# EAGLE design McPiFace-60mmFan-V3.1 (EAGLE 7.4.0)
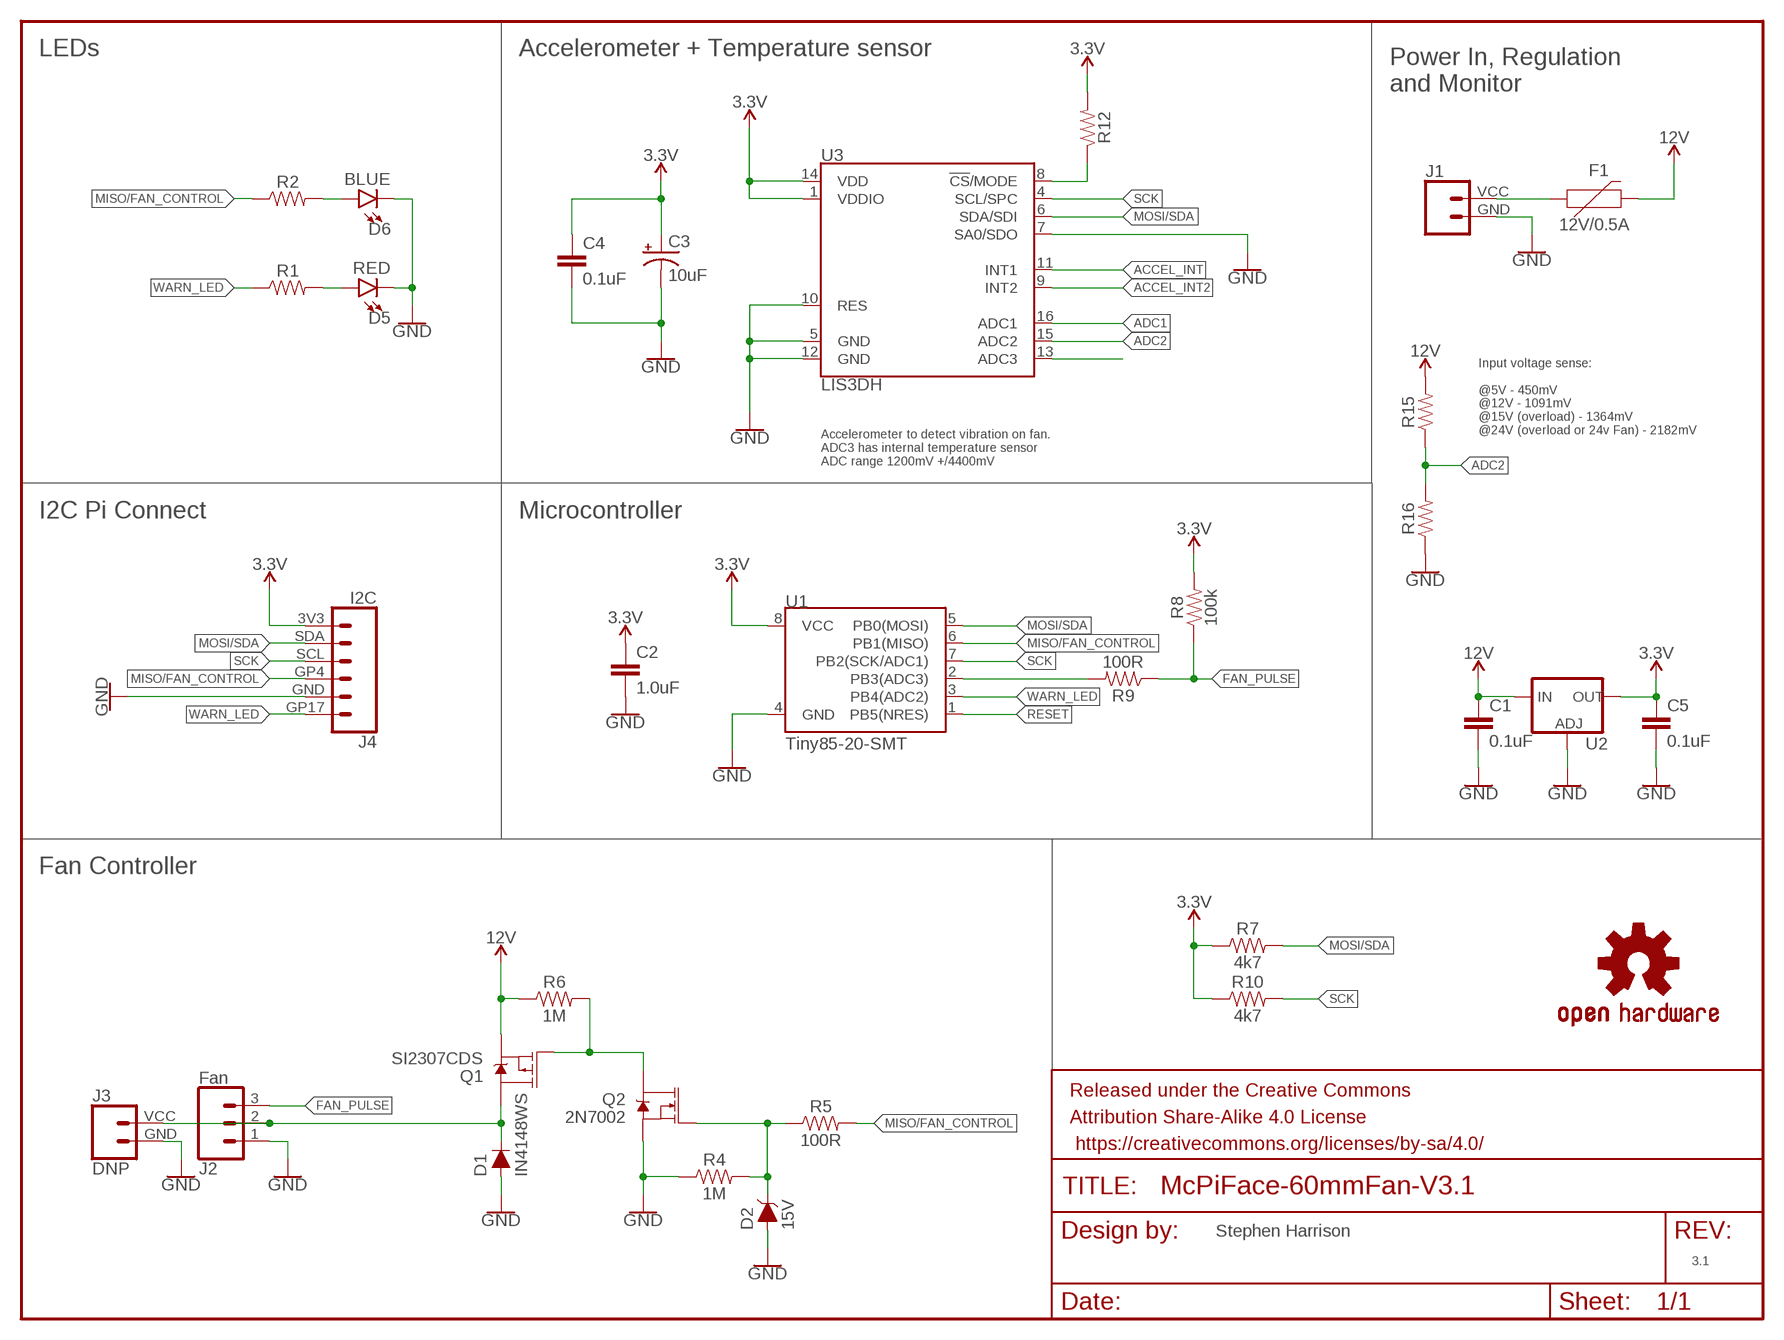
[diagram p0: schematic, sheet 1]

## Parts
C1  0.1uF  0.1UF-0805-25V  [0805]
C2  1.0uF  1.0UF-0805-25V-10%  [0805]
C3  10uF  10UF-16V-10%(TANT)  [EIA3216]
C4  0.1uF  1.0UF-0805-25V-10%  [0805]
C5  0.1uF  0.1UF-0805-25V  [0805]
D1  IN4148WS  DIODE-BAS16J  [SOD-323]
D2  15V  DIODE-ZENER-BZT52C3V6S  [SOD-323]
D5  RED  LED1206  [LED-1206]
D6  BLUE  LED1206  [LED-1206]
F1  12V/0.5A  PPTC_HALF-AMP  [1206]
FRAME1  FRAME-LETTER  [CREATIVE_COMMONS]
J1  CONN_024UCON-15767  [JST-2-SMD-VERT]
J2  Fan  CONN_03JST-SMD  [JST-3-SMD]
J3  DNP  CONN_024UCON-15767  [JST-2-SMD-VERT]
J4  I2C  MC_PI_FACE_I2CTOP  [JST-6-SH-1.0MM-TOP]
LOGO1  OSHW-LOGOL  [OSHW-LOGO-L]
Q1  SI2307CDS  MOSFET_PCH-IRLML2244  [SOT23-3]
Q2  2N7002  MOSFET-NCH-BSS138  [SOT23-3]
R1  RESISTOR0805  [0805]
R2  RESISTOR0805  [0805]
R4  1M  RESISTOR0805  [0805]
R5  100R  RESISTOR0805  [0805]
R6  1M  RESISTOR0805  [0805]
R7  4k7  RESISTOR0805  [0805]
R8  100k  RESISTOR0805  [0805]
R9  100R  RESISTOR0805  [0805]
R10  4k7  RESISTOR0805  [0805]
R12  RESISTOR0805  [0805]
R15  RESISTOR0805  [0805]
R16  RESISTOR0805  [0805]
U1  Tiny85-20-SMT  ATTINY45TINY85-20-SMT  [SO08-EIAJ]
U2  V_REG_LM1117SOT223  [SOT223]
U3  LIS3DH  [LGA-16-3X3]

## Nets
3.3V: C2.1 C3.A(+) C4.1 C5.1 J4.3V3 R7.1 R8.2 R10.1 R12.2 U1.8(VCC) U2.2(OUT) U2.4(OUT) U3.1(VDDIO) U3.14(VDD)
12V: C1.1 F1.2 Q1.2(S) R6.1 R15.2 U2.3(IN)
ACCEL_INT: U3.11(INT1)
ACCEL_INT2: U3.9(INT2)
ADC1: U3.16(ADC1)
ADC2: R15.1 R16.2 U3.15(ADC2)
FAN_PULSE: J2.3 R8.1 R9.1
GND: C1.2 C2.2 C3.C(-) C4.2 C5.2 D1.A D2.A D5.C D6.C J1.GND J2.1 J3.GND J4.GND Q2.2(S) R4.1 R16.1 U1.4(GND) U2.1(ADJ) U3.5(GND) U3.7(SA0/SDO) U3.10(RES) U3.12(GND)
MISO/FAN_CONTROL: J4.GP4 R2.1 R5.2 U1.6(PB1(MISO))
MOSI/SDA: J4.SDA R7.2 U1.5(PB0(MOSI)) U3.6(SDA/SDI)
N$1: R9.2 U1.2(PB3(ADC3))
N$3: D6.A R2.2
N$4: D5.A R1.2
N$5: U3.13(ADC3)
N$6: F1.1 J1.VCC
N$7: R12.1 U3.8(!CS!/MODE)
N$8: D1.C J2.2 J3.VCC Q1.3(D)
N$10: Q1.1(G) Q2.3(D) R6.2
N$11: D2.C Q2.1(G) R4.2 R5.1
RESET: U1.1(PB5(NRES))
SCK: J4.SCL R10.2 U1.7(PB2(SCK/ADC1)) U3.4(SCL/SPC)
WARN_LED: J4.GP17 R1.1 U1.3(PB4(ADC2))

## Notes on the sheet
- LEDs | Accelerometer + Temperature sensor
- Power In, Regulation 
  and Monitor
- Input voltage sense:
  
  @5V - 450mV
  @12V - 1091mV
  @15V (overload) - 1364mV
  @24V (overload or 24v Fan) - 2182mV
- Accelerometer to detect vibration on fan.
  ADC3 has internal temperature sensor
  ADC range 1200mV +/4400mV
- I2C Pi Connect | Microcontroller
- Fan Controller
- Stephen Harrison
- 3.1

## Library data of the parts
C1 C5 = ThingySticks:0.1UF: 0.1µF ceramic capacitors A capacitor is a passive two-terminal electrical component used to store electrical energy temporarily in an electric field.
C2 = SparkFun-Capacitors:1.0UF: 1µF ceramic capacitors A capacitor is a passive two-terminal electrical component used to store electrical energy temporarily in an electric field.; PROD_ID: CAP-08064
C3 = SparkFun-Capacitors:10UF-16V-10%(TANT): CAP-00811 1206/EIA-3216 Tantalum capacitor; PROD_ID: CAP-00811
C4 = SparkFun-Capacitors:1.0UF: 1µF ceramic capacitors A capacitor is a passive two-terminal electrical component used to store electrical energy temporarily in an electric field.; PROD_ID: CAP-08064; VALUE: 1.0uF
D1 = SparkFun-DiscreteSemi:DIODE: Diode These are standard reverse protection diodes and small signal diodes. SparkFun Products: SparkFun SparkPunk Sound Kit <https://www.sparkfun.com/products/11177> SparkFun ESP8266 Thing <https://www.sparkfun.com/products/13231>; LCSC: C2128; PROD_ID: DIO-09646; VALUE: 250mA/100V
D2 = SparkFun-DiscreteSemi:DIODE-ZENER: Zener Diode A Zener diode allows current to flow from its anode to its cathode like a normal semiconductor diode, but it also permits current to flow in the reverse direction when its "Zener voltage" is reached. - WIkipedia; PROD_ID: DIO-08199; VALUE: 3.6V
D5 D6 = ThingySticks:LED: LED (Generic) Standard schematic elements and footprints for 5mm, 3mm, 1206, and 0603 sized LEDs. Generic LEDs with no color specified.
F1 = SparkFun-Fuses:PPTC: Resettable Fuse PPTC Resettable Fuse. Really a sort of resistor with a polymeric positive temperature coefficient whose resistance increases dramatically with an increase in temperature. When heated by the power passing through the resistance rises causing the current to be limited, protecting the circuit. This is achieved by the transition of the polymer from a crystalline to an amorphous state where the conductive carbon separates breaking the conductive pathways found in the cool crystalline structure. When a PPTC cools back down it resumes conducting letting the circuit turn back on. SparkFun Products: SparkFun RedBoard - Programmed with Arduino <https://www.sparkfun.com/products/12757> Pro Micro - 5V/16MHz <https://www.sparkfun.com/products/12640> Arduino Pro 328 - 5V/16MHz <https://www.sparkfun.com/products/10915> MP3 Trigger <https://www.sparkfun.com/products/13720>; PROD_ID: RES-08585; VALUE: 6V/0.5A
FRAME1 = SparkFun-Aesthetics:FRAME-LETTER: Schematic Frame - Letter Standard 8.5x11 US Letter frame
J1 J3 = SparkFun-Connectors:CONN_02: Multi connection point. Often used as Generic Header-pin footprint for 0.1 inch spaced/style header connections On any of the 0.1 inch spaced packages, you can populate with these: Break Away Headers - Straight <https://www.sparkfun.com/products/116> (PRT-00116) Break Away Male Headers - Right Angle <https://www.sparkfun.com/products/553> (PRT-00553) Female Headers <https://www.sparkfun.com/products/115> (PRT-00115) Break Away Headers - Machine Pin <https://www.sparkfun.com/products/117> (PRT-00117) Break Away Female Headers - Swiss Machine Pin <https://www.sparkfun.com/products/743> (PRT-00743) For SCREWTERMINALS and SPRING TERMINALS visit here: Screw Terimnals on SparkFun.com <https://www.sparkfun.com/search/results?term=Screw+Terminals> (5mm/3.5mm/2.54mm spacing) This device is also useful as a general connection point to wire up your design to another part of your project. Our various solder wires solder well into these plated through hole pads. Hook-Up Wire - Assortment (Stranded, 22 AWG) <https://www.sparkfun.com/products/11375> (PRT-11375) Hook-Up Wire - Assortment (Solid Core, 22 AWG) <https://www.sparkfun.com/products/11367> (PRT-11367) View the entire wire category on our website here <https://www.sparkfun.com/categories/141> Special notes: Molex polarized connector foot print use with: PRT-08233 with associated crimp pins and housings. 2.54_SCREWTERM for use with PRT-10571. 3.5mm Screw Terminal footprints for PRT-08084 5mm Screw Terminal footprints for use with PRT-08432
J2 = SparkFun-Connectors:CONN_03: Multi connection point. Often used as Generic Header-pin footprint for 0.1 inch spaced/style header connections On any of the 0.1 inch spaced packages, you can populate with these: Break Away Headers - Straight <https://www.sparkfun.com/products/116> (PRT-00116) Break Away Male Headers - Right Angle <https://www.sparkfun.com/products/553> (PRT-00553) Female Headers <https://www.sparkfun.com/products/115> (PRT-00115) Break Away Headers - Machine Pin <https://www.sparkfun.com/products/117> (PRT-00117) Break Away Female Headers - Swiss Machine Pin <https://www.sparkfun.com/products/743> (PRT-00743) Stackable Header - 3 Pin (Female, 0.1") <https://www.sparkfun.com/products/13875> (PRT-13875) For SCREWTERMINALS and SPRING TERMINALS visit here: Screw Terimnals on SparkFun.com <https://www.sparkfun.com/search/results?term=Screw+Terminals> (5mm/3.5mm/2.54mm spacing) This device is also useful as a general connection point to wire up your design to another part of your project. Our various solder wires solder well into these plated through hole pads. Hook-Up Wire - Assortment (Stranded, 22 AWG) <https://www.sparkfun.com/products/11375> (PRT-11375) Hook-Up Wire - Assortment (Solid Core, 22 AWG) <https://www.sparkfun.com/products/11367> (PRT-11367) View the entire wire category on our website here <https://www.sparkfun.com/categories/141> Special notes: Molex polarized connector foot print use with SKU : PRT-08232 with associated crimp pins and housings.; FARNELL: 9492623; MFG: S3B-PH-SM4-TB(LF)(SN); PROD_ID: CONN-12591; VALUE: 3-PIN SMD
J4 = McPiFace:MC_PI_FACE_I2C
LOGO1 = SparkFun-Aesthetics:OSHW-LOGO: Open-Source Hardware (OSHW) Logo This logo indicates the piece of hardware it is found on incorporates a OSHW license and/or adheres to the definition of open source hardware found here: http://freedomdefined.org/OSHW
Q1 = SparkFun-DiscreteSemi:MOSFET_PCH: P-channel MOSFETs Voltage controlled devices that allow control of high current outputs. SparkFun Products: SparkFun ESP32 Thing <https://www.sparkfun.com/products/13907> SparkFun ESP8266 Thing <https://www.sparkfun.com/products/13231>; FARNELL: 1779262; LCSC: C189813; PROD_ID: TRANS-11153; VALUE: 4.3A/20V/54mΩ
Q2 = SparkFun-DiscreteSemi:MOSFET-NCH: N-channel MOSFETs Voltage controlled devices that allow control of high current outputs. SparkFun Products: SparkFun OpenScale <https://www.sparkfun.com/products/13261> SparkFun Digital Sandbox <https://www.sparkfun.com/products/12651> SparkFun Monster Moto Shield <https://www.sparkfun.com/products/10182> SparkFun MOSFET Power Controller <https://www.sparkfun.com/products/11214>; FARNELL: 1510761; PROD_ID: TRANS-00830; VALUE: 220mA/50V/3.5Ω
R1 R2 R4-R10 R12 R15 R16 = SparkFun-Resistors:RESISTOR: Generic Resistor Package
U1 = SparkFun-DigitalIC:ATTINY45: Atmel 8-pin 2/4/8kB flash uC; PROD_ID: IC-09092
U2 = SparkFun-IC-Power:V_REG_LM1117: Voltage Regulator LM1117 Standard adjustable voltage regulator but in SMD form. Spark Fun Electronics SKU : COM-00595; LCSC: C126027; PROD_ID: VREG-08170
U3 = SparkFun-Sensors:LIS3DH: ST Microelectronics LIS3DH 3-Axis ±2/4/8/16g SPI/I2C Accelerometer The LIS3DH is a three axis MEMS linear accelerometer in the "nano" family. It has a digital I2C/SPI serial interface which makes it ideal for using in embedded applications. The device also features ultra low-power operational modes that allow advanced power saving and smart sleep to wake-up functions, built in detections with interrupts, and auxiliary ADC inputs Datasheet-XXXX <http://www.sparkfun.com/datasheets/Sensors/Accelerometer/LIS3DH.pdf> SparkFun Products SparkFun Triple Axis Accelerometer Breakout - LIS3DH <https://www.sparkfun.com/products/10345> (SEN-XXXXX) Triple Axis Accelerometer - LIS3DH <https://www.sparkfun.com/products/9755> (SEN-XXXXX); PROD_ID: IC-13419; SF_ID: N/A

## Board
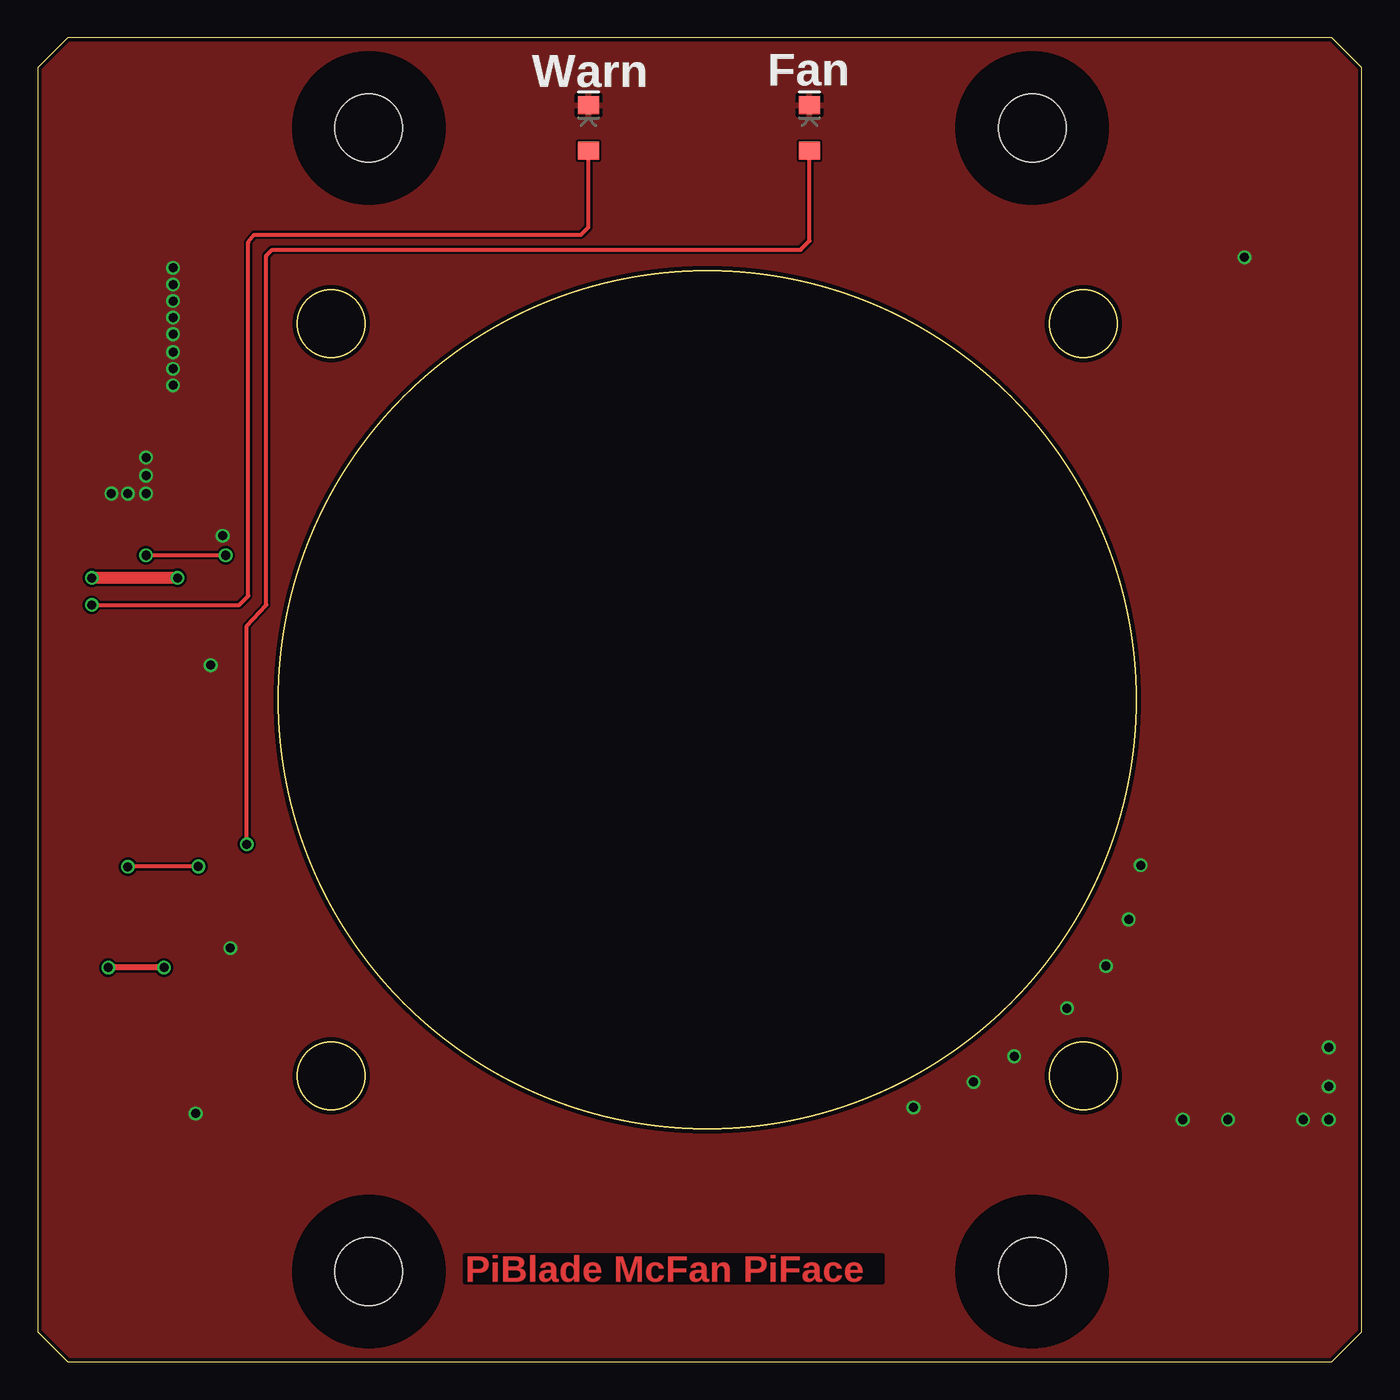
[diagram p1: board, top side]
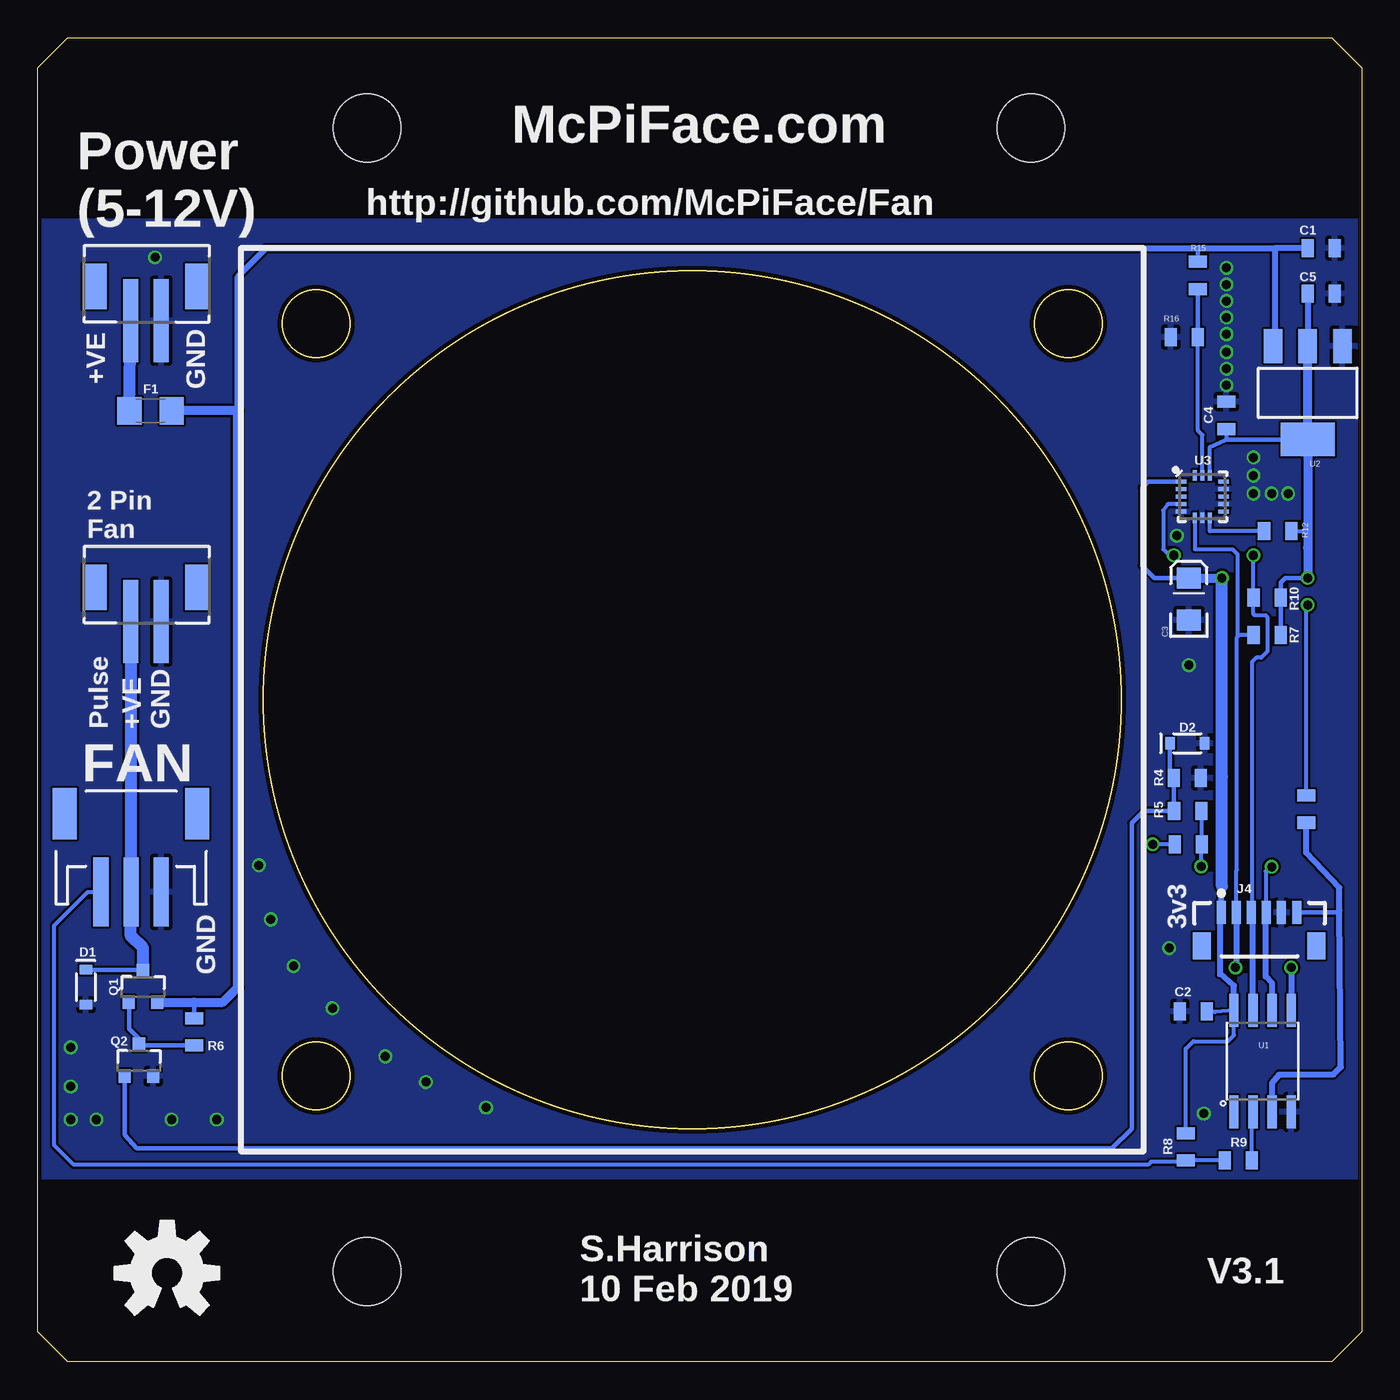
[diagram p2: board, bottom side, seen from below]

Size 88 x 88 mm. Coordinates in mm from the lower left corner, seen from the top.
Outline: 2,0 86,0 88,2 88,86 86,88 2,88 0,86 0,2 2,0
Outline: circle at 44.5,44 radius 28.5
Outline: circle at 19.5,69 radius 2.25
Outline: circle at 69.5,69 radius 2.25
Outline: circle at 69.5,19 radius 2.25
Outline: circle at 19.5,19 radius 2.25
Copper layers (1*16): Top 0.035mm / dielectric 1.5mm / Bottom 0.035mm
Design rules "dirt_cheap_dirty_boards.v1.1": minimum track width 6mil, minimum drill 12mil, track to track 6mil, track to pad 6mil, pad to pad 6mil, via to via 6mil, smd to smd 0mil, copper to edge 10mil, drill to drill 10mil, minimum pad ring 10mil, minimum via ring 6mil, stop-mask expansion 2mil, vias tented up to drill 25mil, thermal gap 10mil
Holes 4.5 mm at 22,6 22,82 66.1,82 66.1,6
bKeepout: area 0,76 to 88,88; area 0,0 to 88,12.1
tRestrict: area 17,77 to 27,87; area 17,1 to 27,11; area 61.1,1 to 71.1,11; area 61.1,77 to 71.1,87
bRestrict: area 0,76 to 88,88; area 0,0 to 88,12.1

### Footprints (pad centres in the part's own frame; a part is rotated, then mirrored left to right if it is on the bottom)
0805 = smd 0.8 x 1.2: 1 -0.9,0; 2 0.9,0
EIA3216 = smd 1.4 x 1.6: A 1.4,0; C -1.4,0
SOD-323 = smd 0.63 x 0.83: A 1.15,0; C -1.15,0
LED-1206 = smd 1.2 x 1.4: A -1.5,0; C 1.5,0
1206 = smd 1.6 x 1.8: 1 -1.4,0; 2 1.4,0
JST-2-SMD-VERT = smd 1 x 5.5: GND 1,-2; VCC -1,-2 | smd 1.6 x 3: P$1 -3.4,0.27; P$2 3.4,0.27
JST-3-SMD = smd 1 x 4.6: 1 2.01,-4.77; 2 0.01,-4.77; 3 -1.99,-4.77 | smd 1.6 x 3.4: NC1 -4.39,0.43; NC2 4.41,0.43
JST-6-SH-1.0MM-TOP = smd 0.6 x 1.55: 3V3 -2.54,1.27; GND 1.46,1.27; GP4 0.46,1.27; GP17 2.46,1.27; SCL -0.54,1.27; SDA -1.54,1.27 | smd 1.2 x 1.8: P$1 -3.84,-0.955; P$2 3.76,-0.955
SOT23-3 = smd 0.8 x 0.9: 1 -0.95,-1; 2 0.95,-1; 3 0,1.1
SO08-EIAJ = smd 0.61 x 2.21: 1 -1.905,-3.378; 2 -0.635,-3.378; 3 0.635,-3.378; 4 1.905,-3.378; 5 1.905,3.353; 6 0.635,3.353; 7 -0.635,3.353; 8 -1.905,3.353
SOT223 = smd 1.219 x 2.235: 1 -2.311,-3.099; 2 0,-3.099; 3 2.311,-3.099 | smd 3.6 x 2.2: 4 0,3.099
LGA-16-3X3 = smd 0.7 x 0.28: 1 -1.4,1; 2 -1.4,0.5; 3 -1.4,0; 4 -1.4,-0.5; 5 -1.4,-1; 9 1.4,-1; 10 1.4,-0.5; 11 1.4,0; 12 1.4,0.5; 13 1.4,1 | smd 0.28 x 0.7: 6 -0.5,-1.4; 7 0,-1.4; 8 0.5,-1.4; 14 0.5,1.4; 15 0,1.4; 16 -0.5,1.4

### Placement (x,y rotation side)
C1  2.7,74 0 bottom
C2  11.2,23.3 180 bottom
C3  11.5,50.7 90 bottom
C4  9,62.9 90 bottom
C5  2.7,71 0 bottom
D1  84.8,24.9 270 bottom
D2  11.6,41.1 0 bottom
D5  36.6,82 90 top
D6  51.3,82 90 top
F1  80.5,63.2 0 bottom
FRAME1  6.2,-14.8 0 top  (outside the outline)
J1  80.8,71.2 0 bottom
J2  81.8,36 0 bottom
J3  80.8,51.2 0 bottom
J4  6.8,28.6 0 bottom
LOGO1  79.4,5.9 0 bottom
Q1  81,24.9 0 bottom
Q2  81.27,20 0 bottom
R1  3.69,36.73 90 bottom
R2  11.53,34.38 180 bottom
R4  11.6,38.8 180 bottom
R5  11.58,36.6 0 bottom
R6  77.6,21.93 270 bottom
R7  6.3,48.3 180 bottom
R8  11.7,14.3 90 bottom
R9  8.2,13.4 0 bottom
R10  6.3,50.8 180 bottom
R12  5.6,55.2 0 bottom
R15  10.9,72.2 90 bottom
R16  11.8,68.1 0 bottom
U1  6.6,20 0 bottom
U2  3.6,64.4 180 bottom
U3  10.6,57.5 0 bottom

### Tracks (layer width: path | path; a pad name or v marks a point on that pad's centre or on a via)
3.3V  (via drill 0.6)
  Top 0.813: v9.3,52.1 v3.6,52.1
  Bottom 0.254: U3.14 10.1,60.8 9,61.3 C4.1 | R12.2 3.6,55.2 | 9.6,38.8 9.3,38.9 | C2.1 9.75,23.25 U1.8 8.5,23.25 8.5,21.7 8.9,21.3 11.2,21.3 11.7,20.8 R8.2 | 9.5,25.7 9.4,25.8
  Bottom 0.305: 9,61.3 3.7,61.3 | 3.7,54 3.6,54.1 | R7.1 R10.1 5.4,51.8 5.1,52.1 v3.6,52.1 | U3.1 14.2,58.5 14.6,58.1 14.6,52.9 13.8,52.1 C3.A | 3.6,55.2 3.6,55.3
  Bottom 0.406: C5.1 U2.2 | 3.7,55.4 3.6,55.3 | 3.7,61.3 U2.4 | 9.3,31.6 9.34,33.16 J4.3V3 9.4,29.81 9.4,25.8 8.51,25 U1.8
  Bottom 0.61: v3.6,52.1 3.6,54.1 3.6,55.2 U2.4 U2.2 | C3.A v9.3,52.1
  Bottom 0.813: 9.3,31.6 9.3,38.9 v9.3,52.1
12V
  Bottom 0.305: R15.2 10.9,74 | R6.1 77.6,23.9
  Bottom 0.406: 6,66.69 U2.3 | 74.7,63.2 74.7,72.1 72.8,74 10.9,74 5.8,74 | 5.8,74 5.8,66.71 | C1.1 5.8,74
  Bottom 0.61: 5.8,66.71 U2.3 | Q1.2 77.6,23.9 75.7,23.9 74.7,24.9 74.7,63.2 F1.2
ADC2
  Bottom 0.254: U3.15 10.6,61.6 10.9,61.9 10.9,68.8
  Bottom 0.305: 10.9,68.8 R16.2 R15.1
FAN_PULSE
  Bottom 0.254: J2.3 84.68,31.22 86.9,29 86.9,14.4 85.6,13.1 14.2,13.1 14,13.3 11.9,13.3 R8.1 R9.1
  Bottom 0.305: 83.69,31.14 J2.3
  Bottom 0.406: 83.96,31.06 J2.3 83.9,31.12
GND  (via drill 0.6)
  other vias: 80.2,73.4 11.5,46.3 9,67.1 12.8,27.5 10.5,16.5 12.3,54.9 7.2,57.7 9,68.3 9,69.4 9,70.5 9,71.6 9,66 9,64.9 7.2,58.9 7.2,60.1 6,57.7 4.9,57.7 9,72.7 76.1,16.1 79.1,16.1 84.1,16.1 85.8,16.1 85.8,18.3 85.8,20.9 71,26.3 64.9,20.3 62.2,18.6 58.2,16.9 68.4,23.5 72.5,29.4 73.3,33
  pour Top: -1,88.5 88.7,88.5 88.7,-1 -1,-1
  pour Bottom: -1,88.5 88.7,88.5 88.7,-1 -1,-1
MISO/FAN_CONTROL  (via drill 0.6)
  Top 0.254: v10.68,32.92 6.02,32.92 v6,32.9
  Bottom 0.254: 10.63,34.85 10.68,34.9 | 6,23.22 U1.6 | v10.68,32.92 10.68,34.33 R2.1 10.63,34.85 | 10.63,34.85 10.63,36.55 R5.2 | v6,32.9 6.4,32.6 6.4,29.93 J4.GP4
  Bottom 0.406: U1.6 5.96,25.16 6.4,25.6 6.4,29.81 J4.GP4
MOSI/SDA  (via drill 0.6)
  Top 0.406: v8.4,26.2 v4.7,26.2
  Bottom 0.254: 8.26,48.2 8.26,53.66 8.6,54 11.1,54 U3.6 | R7.2 8.16,48.3 8.26,48.2 | J4.SDA 8.34,32.66 8.3,32.7 8.3,48.14 8.26,48.2
  Bottom 0.406: J4.SDA 8.34,26.24 v8.4,26.2 | v4.7,26.2 4.7,23.26 U1.5
N$1
  Bottom 0.254: R9.2 7.3,16.46 U1.2
N$3  (via drill 0.6)
  Top 0.254: v13.9,34.4 13.9,48.9 15.2,50.3 15.2,73.5 15.6,73.9 50.7,73.9 51.3,74.5 D6.A
  Bottom 0.254: R2.2 13.88,34.38 v13.9,34.4
N$4  (via drill 0.6)
  Top 0.254: v3.6,50.3 13.4,50.3 14,50.9 14,74.4 14.4,74.9 36.1,74.9 36.6,75.4 D5.A
  Bottom 0.254: R1.2 3.69,50.09 v3.6,50.3
N$6
  Bottom 0.813: F1.1 J1.VCC
N$7
  Bottom 0.254: R12.1 10.1,55.2 U3.8
N$8
  Bottom 0.305: D1.C 81.05,26.05 Q1.3
  Bottom 0.813: Q1.3 81,27.5 81.8,28.3 J2.2 J3.VCC
N$10
  Bottom 0.305: Q1.1 81.92,23.86 81.92,22.11 81.27,21.46 Q2.3 81.22,21.05 79.17,21.05 77.99,21.03 R6.2
N$11
  Bottom 0.305: Q2.1 82.2,18.68 82.2,15.1 81.4,14.2 16.6,14.2 15.3,15.5 15.3,35.8 14.49,36.6 R5.1 12.5,36.62 R4.2 12.75,39.05 D2.C
SCK  (via drill 0.6)
  Top 0.254: v7.2,53.6 v12.5,53.6
  Bottom 0.254: U3.4 12.9,57 13.2,56.6 13.2,54 12.8,53.6 v12.5,53.6 | J4.SCL 7.3,29.91 7.3,46.5 7,46.8 6.7,46.8 6.26,47.24 6.26,49.46 6.4,49.6 7.1,49.6 7.2,49.7 R10.2 v7.2,53.6
  Bottom 0.406: U1.7 7.24,29.77 J4.SCL
WARN_LED
  Bottom 0.305: J4.GP17 1.62,29.87 1.49,30
  Bottom 0.406: U1.3 5.96,18.54 5.5,19.1 1.9,19.1 1.4,19.6 1.49,30 1.5,31.5 3.7,33.83 R1.1

### Text on the board
Top: PiBlade McFan PiFace
tNames: Warn | Fan
bNames: McPiFace.com | http://github.com/McPiFace/Fan | Power / (5-12V) | GND | +VE | 2 Pin / Fan | GND | +VE | Pulse | FAN | GND | 3v3 | V3.1 | S.Harrison / 10 Feb 2019